# Altium schematic sheet Deel_2_brug_gelijkrichter.SchDoc: Soldeerstation
size A4; DrawnBy: Kenneth Rennen; Revision: 1.0; SheetNumber: 2; SheetTotal: 5; Sheet of: 2/5; Number: PXL_1EAI_12102667
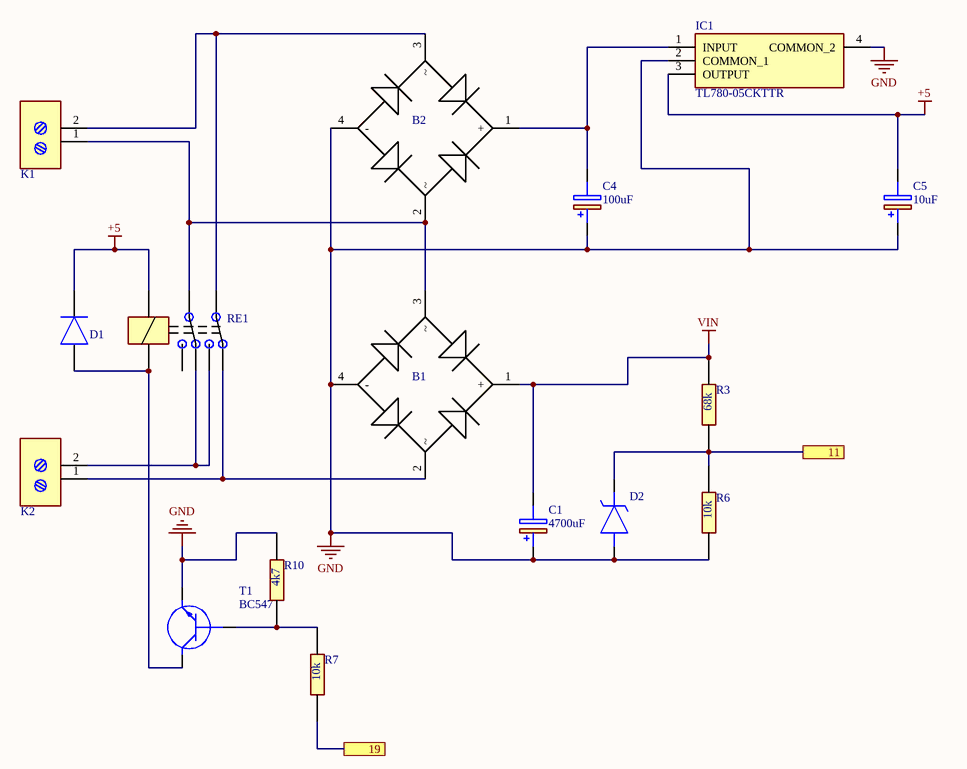
[diagram p0: Deel_2_brug_gelijkrichter.SchDoc]

## Parts
B1  bruggelijkrichter  [GBU606G]  (value not drawn)
B2  bruggelijkrichter  [GBU606G]  (value not drawn)
C1  4700uF  [4700uf]
C4  100uF  [100uf]
C5  10uF  [10uf]
D1  FM4007W-W  [fm4007]  (value not drawn)
D2  MMSZ4689T1G zener  [mmsz4]  (value not drawn)
IC1  TL780-05CKTTR  [TL78005CKTTR]  (net tie)
K1  schroefconnector  [schroefconnector]  (value not drawn)
K2  schroefconnector  [schroefconnector]  (value not drawn)
R3  68k  [68k]
R6  10k  [10k]
R7  10k  [10k]
R10  4k7  [4k7]
RE1  RT424005 relais  [RT42005]  (value not drawn)
T1  BC547  [BC547CBU]

## Ports
11, 19

## Nets
+5: C5.2(-) D1.1(K) IC1.3(OUTPUT) RE1.1(A1_COIL)
GND: B1.4(-) B2.4(-) C1.1(+) C4.1(+) C5.1(+) D2.2(A) IC1.2(COMMON_1) IC1.4(COMMON_2) R6.1 R10.2 T1.3(E)
VIN: B1.1(+) C1.2(-) R3.2
11: D2.1(K) R3.1 R6.2 ; port 11
19: R7.1 ; port 19
NetB1_2: B1.2 K2.1 RE1.7(22_NC)
NetB1_3: B1.3 B2.2 K1.1 RE1.3(11_COM)
NetB2_1: B2.1(+) C4.2(-) IC1.1(INPUT)
NetB2_3: B2.3 K1.2 RE1.6(21_COM)
NetD1_2: D1.2(A) RE1.8(A2_COIL) T1.1(C)
NetK2_2: K2.2 RE1.2(12_NC) RE1.5(24_NO)
NetR7_2: R7.2 R10.1 T1.2(B)

Not connected (* = marked no-connect by the designer): RE1 4(14_NO)

## Library data of the parts
B1 B2 = bruggelijkrichter: Bridge Rectifier GBU606-G; Manufacturer_Name: Comchip Technology; Datasheet Link: https://www.comchiptech.com/product.php?id=2217; Height: 20.95mm; Manufacturer_Part_Number: GBU606-G
C1 = 4700uF: Capacitor Polarised 50PK4700MEFC18X40; Manufacturer_Name: Rubycon; Datasheet Link: https://componentsearchengine.com//50PK4700MEFC18X40.pdf; Height: 41.5mm; Mouser2 Part Number: 232-50PK4700MEFC18X4; Mouser2 Price/Stock: https://www.mouser.com/Search/Refine.aspx?Keyword=232-50PK4700MEFC18X4; Manufacturer_Part_Number: 50PK4700MEFC18X40
C4 = 100uF: Capacitor Polarised RGA101M1HBK-0811G; Manufacturer_Name: Lelon; Datasheet Link: https://www.arrow.com/en/products/rga101m1hbk-0811g/lelon-electronics; Height: 13mm; Manufacturer_Part_Number: RGA101M1HBK-0811G
C5 = 10uF: Capacitor Polarised 860020672010; Manufacturer_Name: Wurth Elektronik; Datasheet Link: https://componentsearchengine.com//860020672010.pdf; Height: 12.5mm; Mouser2 Part Number: 710-860020672010; Mouser2 Price/Stock: https://www.mouser.com/Search/Refine.aspx?Keyword=710-860020672010; Manufacturer_Part_Number: 860020672010
D1 = FM4007W-W: Bridge Rectifier; Manufacturer_Name: Rectron; Datasheet Link: https://componentsearchengine.com//FM4007W-W.pdf; Height: 2.31mm; Mouser2 Part Number: 583-FM4007W-W; Mouser2 Price/Stock: https://www.mouser.com/Search/Refine.aspx?Keyword=583-FM4007W-W; Manufacturer_Part_Number: FM4007W-W
D2 = MMSZ4689T1G zener: Zener Diode; Manufacturer_Name: ON Semiconductor; Datasheet Link: https://componentsearchengine.com//MMSZ4689T1G.pdf; Height: 1.35mm; Mouser2 Part Number: 863-MMSZ4689T1G; Mouser2 Price/Stock: https://www.mouser.com/Search/Refine.aspx?Keyword=863-MMSZ4689T1G; Manufacturer_Part_Number: MMSZ4689T1G
IC1 = TL780-05CKTTR: Integrated Circuit spanningsregelaar; Manufacturer_Name: Texas Instruments; Datasheet Link: http://www.ti.com/general/docs/suppproductinfo.tsp?distId=26&gotoUrl=http%3A%2F%2Fwww.ti.com%2Flit%2Fgpn%2Ftl780; Height: 5.08mm; Manufacturer_Part_Number: TL780-05CKTTR
K1 K2 = schroefconnector: Connector 1716020000; Manufacturer_Name: Weidmuller; Datasheet Link: https://catalog.weidmueller.com/catalog/Start.do?ObjectID=1716020000&_ga=2.21797499.1716783809.1613378202-511725545.1613378202; Manufacturer_Part_Number: 1716020000
R3 = 68k: Resistor; Manufacturer_Name: TE Connectivity; Manufacturer_Part_Number: CPF0805B100RE1; Datasheet Link: https://datasheet.datasheetarchive.com/originals/distributors/DKDS-21/401696.pdf; Height: 0.65mm; Mouser Part Number: 279-CPF0805B100RE1; Mouser Price/Stock: https://www.mouser.co.uk/ProductDetail/TE-Connectivity-Holsworthy/CPF0805B100RE1?qs=9ylKvqdyudkCWLPT1QvLZQ%3D%3D; Arrow Part Number: CPF0805B100RE1; Arrow Price/Stock: https://www.arrow.com/en/products/cpf0805b100re1/te-connectivity?region=nac
R6 R7 = 10k: Resistor; Manufacturer_Name: TE Connectivity; Manufacturer_Part_Number: CPF0805B100RE1; Datasheet Link: https://datasheet.datasheetarchive.com/originals/distributors/DKDS-21/401696.pdf; Height: 0.65mm; Mouser Part Number: 279-CPF0805B100RE1; Mouser Price/Stock: https://www.mouser.co.uk/ProductDetail/TE-Connectivity-Holsworthy/CPF0805B100RE1?qs=9ylKvqdyudkCWLPT1QvLZQ%3D%3D; Arrow Part Number: CPF0805B100RE1; Arrow Price/Stock: https://www.arrow.com/en/products/cpf0805b100re1/te-connectivity?region=nac
R10 = 4k7: Resistor; Manufacturer_Name: TE Connectivity; Manufacturer_Part_Number: CPF0805B100RE1; Datasheet Link: https://datasheet.datasheetarchive.com/originals/distributors/DKDS-21/401696.pdf; Height: 0.65mm; Mouser Part Number: 279-CPF0805B100RE1; Mouser Price/Stock: https://www.mouser.co.uk/ProductDetail/TE-Connectivity-Holsworthy/CPF0805B100RE1?qs=9ylKvqdyudkCWLPT1QvLZQ%3D%3D; Arrow Part Number: CPF0805B100RE1; Arrow Price/Stock: https://www.arrow.com/en/products/cpf0805b100re1/te-connectivity?region=nac
RE1 = RT424005 relais: Relay or Contactor; Manufacturer_Name: TE Connectivity; Datasheet Link: https://componentsearchengine.com//RT424005.pdf; Mouser2 Part Number: 655-RT424005; Mouser2 Price/Stock: https://www.mouser.com/Search/Refine.aspx?Keyword=655-RT424005; Manufacturer_Part_Number: RT424005
T1 = BC547CBU: Transistor BJT NPN; Manufacturer_Name: ON Semiconductor; Datasheet Link: https://www.onsemi.com/pdf/datasheet/bc550-d.pdf; Height: 5.33mm; Manufacturer_Part_Number: BC547CBU